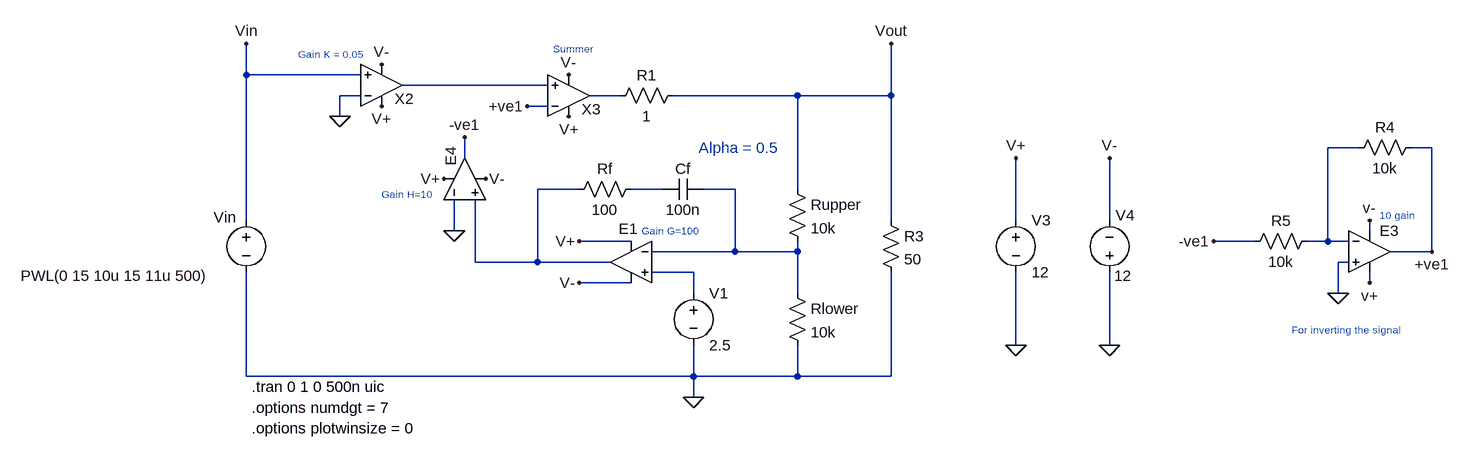
[diagram p0: schematic LDO - Closed Loop_Input Change.asc]
LDO - Closed Loop_Input Change.asc, the LTspice schematic file:
Version 4
SHEET 1 1952 680
WIRE 80 -80 80 -128
WIRE 256 -80 80 -80
WIRE 544 -64 320 -64
WIRE 256 -48 224 -48
WIRE 656 -48 608 -48
WIRE 928 -48 736 -48
WIRE 1072 -48 1072 -128
WIRE 1072 -48 928 -48
WIRE 544 -32 512 -32
WIRE 224 -16 224 -48
WIRE 1792 32 1744 32
WIRE 1904 32 1872 32
WIRE 416 48 416 16
WIRE 592 96 528 96
WIRE 720 96 672 96
WIRE 832 96 784 96
WIRE 928 96 928 -48
WIRE 80 144 80 -80
WIRE 1072 144 1072 -48
WIRE 1264 144 1264 48
WIRE 1408 144 1408 48
WIRE 400 160 400 112
WIRE 1808 160 1808 144
WIRE 672 176 592 176
WIRE 1632 176 1568 176
WIRE 1744 176 1744 32
WIRE 1744 176 1712 176
WIRE 1776 176 1744 176
WIRE 832 192 832 96
WIRE 832 192 704 192
WIRE 928 192 928 176
WIRE 928 192 832 192
WIRE 1904 192 1904 32
WIRE 1904 192 1840 192
WIRE 432 208 432 112
WIRE 528 208 528 96
WIRE 528 208 432 208
WIRE 640 208 528 208
WIRE 1776 208 1760 208
WIRE 768 224 704 224
WIRE 672 240 592 240
WIRE 1808 240 1808 224
WIRE 768 256 768 224
WIRE 928 256 928 192
WIRE 1760 256 1760 208
WIRE 1264 336 1264 224
WIRE 1408 336 1408 224
WIRE 80 384 80 224
WIRE 768 384 768 336
WIRE 768 384 80 384
WIRE 928 384 928 336
WIRE 928 384 768 384
WIRE 1072 384 1072 224
WIRE 1072 384 928 384
WIRE 768 416 768 384
FLAG 592 176 V+
FLAG 592 240 V-
FLAG 1264 336 0
FLAG 1408 336 0
FLAG 1264 48 V+
FLAG 1408 48 V-
FLAG 768 416 0
FLAG 1760 256 0
FLAG 1904 192 +ve1
FLAG 1808 144 v-
FLAG 1808 240 v+
FLAG 1568 176 -ve1
FLAG 400 160 0
FLAG 384 80 V+
FLAG 448 80 V-
FLAG 416 16 -ve1
FLAG 288 -32 V+
FLAG 288 -96 V-
FLAG 224 -16 0
FLAG 576 -16 V+
FLAG 576 -80 V-
FLAG 512 -32 +ve1
FLAG 1072 -128 Vout
FLAG 80 -128 Vin
SYMBOL voltage 80 128 R0
WINDOW 123 0 0 Left 0
WINDOW 39 0 0 Left 0
WINDOW 0 -50 11 Left 2
WINDOW 3 -347 101 Left 2
SYMATTR InstName Vin
SYMATTR Value PWL(0 15 10u 15 11u 500)
SYMBOL voltage 768 240 R0
WINDOW 123 0 0 Left 0
WINDOW 39 0 0 Left 0
SYMATTR InstName V1
SYMATTR Value 2.5
SYMBOL res 912 80 R0
SYMATTR InstName Rupper
SYMATTR Value 10k
SYMBOL res 912 240 R0
SYMATTR InstName Rlower
SYMATTR Value 10k
SYMBOL res 1056 128 R0
SYMATTR InstName R3
SYMATTR Value 50
SYMBOL voltage 1264 128 R0
SYMATTR InstName V3
SYMATTR Value 12
SYMBOL voltage 1408 240 R180
WINDOW 123 0 0 Left 0
WINDOW 39 0 0 Left 0
WINDOW 0 -39 104 Left 2
WINDOW 3 -34 11 Left 2
SYMATTR InstName V4
SYMATTR Value 12
SYMBOL OpAmps\\UniversalOpAmp1 1808 192 R0
SYMATTR InstName E3
SYMATTR Value2 Avol=10 GBW=10Meg Vos=0
SYMBOL res 1888 16 R90
WINDOW 0 0 56 VBottom 2
WINDOW 3 32 56 VTop 2
SYMATTR InstName R4
SYMATTR Value 10k
SYMBOL res 1728 160 R90
WINDOW 0 0 56 VBottom 2
WINDOW 3 32 56 VTop 2
SYMATTR InstName R5
SYMATTR Value 10k
SYMBOL OpAmps\\UniversalOpAmp1 672 208 M0
WINDOW 0 -10 -51 Left 2
SYMATTR InstName E1
SYMATTR Value2 Avol=100 GBW=10Meg Vos=0
SYMBOL cap 784 80 R90
WINDOW 0 0 32 VBottom 2
WINDOW 3 32 32 VTop 2
SYMATTR InstName Cf
SYMATTR Value 100n
SYMBOL res 688 80 R90
WINDOW 0 0 56 VBottom 2
WINDOW 3 32 56 VTop 2
SYMATTR InstName Rf
SYMATTR Value 100
SYMBOL OpAmps\\UniversalOpAmp1 416 80 R270
WINDOW 0 20 -21 Left 2
SYMATTR InstName E4
SYMATTR Value2 Avol=100 GBW=10Meg Vos=0
SYMBOL OpAmps\\UniversalOpAmp1 288 -64 M180
WINDOW 0 20 -21 Left 2
SYMATTR InstName X2
SYMATTR Value2 Avol=0.05 GBW=10Meg Vos=0
SYMBOL OpAmps\\UniversalOpAmp1 576 -48 M180
WINDOW 0 20 -21 Left 2
SYMATTR InstName X3
SYMATTR Value2 Avol=1 GBW=10Meg Vos=0
SYMBOL res 752 -64 R90
WINDOW 0 0 56 VBottom 2
WINDOW 3 32 56 VTop 2
SYMATTR InstName R1
SYMATTR Value 1
TEXT 88 400 Left 2 !.tran 0 1 0 500n uic
TEXT 688 160 Left 1 ;Gain G=100
TEXT 88 432 Left 2 !.options numdgt = 7
TEXT 88 464 Left 2 !.options plotwinsize = 0
TEXT 288 104 Left 1 ;Gain H=10
TEXT 160 -112 Left 1 ;Gain K = 0.05
TEXT 552 -120 Left 1 ;Summer
TEXT 1824 136 Left 1 ;10 gain
TEXT 776 32 Left 2 ;Alpha = 0.5
TEXT 1688 312 Left 1 ;For inverting the signal

The netlist it stands for:
* LDO - Closed Loop_Input Change.asc
Vin Vin 0 PWL(0 15 10u 15 11u 500)
V1 N007 0 2.5
Rupper Vout N006 10k
Rlower N006 0 10k
R3 Vout 0 50
V3 V+ 0 12
V4 0 V- 12
XE3 0 N003 V- V+ +ve1 level1 Avol=10 GBW=10Meg Vos=0 En=0 Enk=0 In=0 Ink=0 Rin=500Meg  ; pins In+ In- V+ V- OUT
R4 +ve1 N003 10k
R5 N003 -ve1 10k
XE1 N007 N006 V+ V- N004 level1 Avol=100 GBW=10Meg Vos=0 En=0 Enk=0 In=0 Ink=0 Rin=500Meg  ; pins In+ In- V+ V- OUT
Cf N006 N005 100n
Rf N005 N004 100
XE4 N004 0 V+ V- -ve1 level1 Avol=100 GBW=10Meg Vos=0 En=0 Enk=0 In=0 Ink=0 Rin=500Meg  ; pins In+ In- V+ V- OUT
XX2 Vin 0 V+ V- N001 level1 Avol=0.05 GBW=10Meg Vos=0 En=0 Enk=0 In=0 Ink=0 Rin=500Meg  ; pins In+ In- V+ V- OUT
XX3 N001 +ve1 V+ V- N002 level1 Avol=1 GBW=10Meg Vos=0 En=0 Enk=0 In=0 Ink=0 Rin=500Meg  ; pins In+ In- V+ V- OUT
R1 Vout N002 1
.tran 0 1 0 500n uic
* Gain G=100
.options numdgt = 7
.options plotwinsize = 0
* Gain H=10
* Gain K = 0.05
* Summer
* 10 gain
* Alpha = 0.5
* For inverting the signal
.lib UniversalOpAmp1.lib
.backanno
.end